# Altium schematic sheet pk36.SchDoc
size A4; SheetNumber: 1; SheetTotal: 1
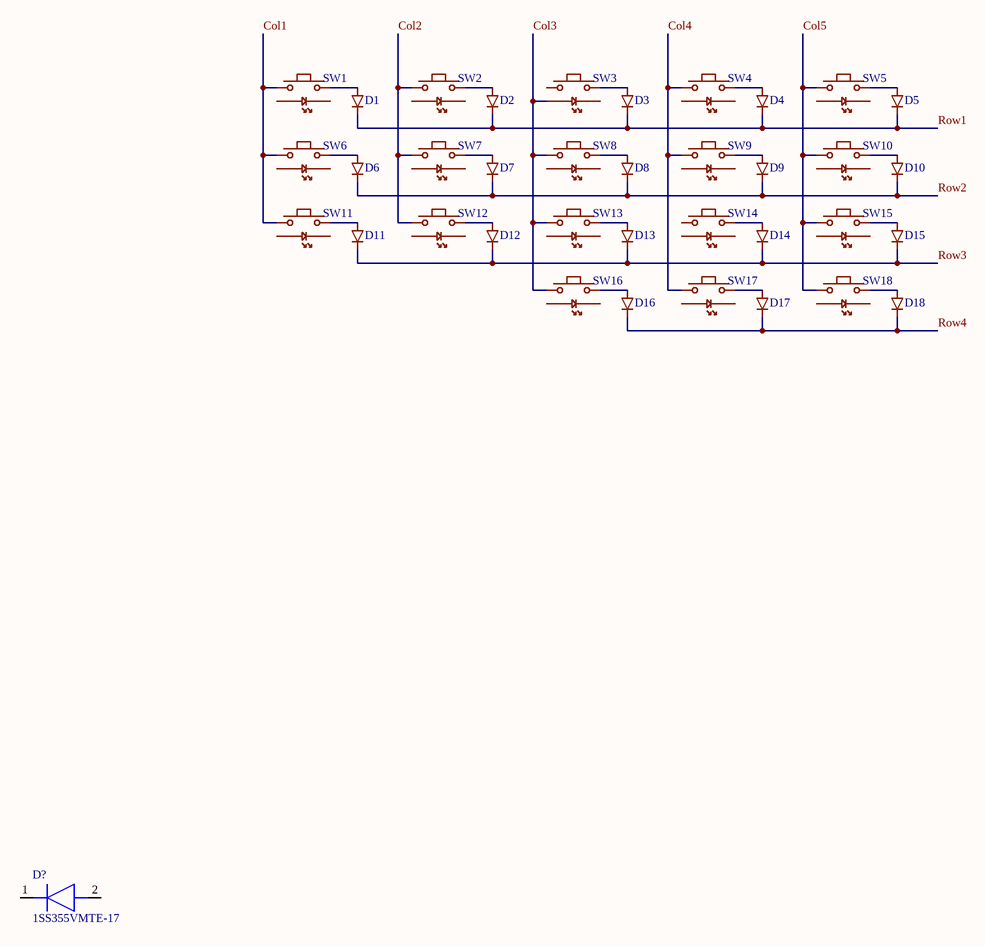
[diagram p0: pk36.SchDoc]

## Parts
D1  (no value)  [UDZVTE1722B]
D2  (no value)  [UDZVTE1722B]
D3  (no value)  [UDZVTE1722B]
D4  (no value)  [UDZVTE1722B]
D5  (no value)  [UDZVTE1722B]
D6  (no value)  [UDZVTE1722B]
D7  (no value)  [UDZVTE1722B]
D8  (no value)  [UDZVTE1722B]
D9  (no value)  [UDZVTE1722B]
D10  (no value)  [UDZVTE1722B]
D11  (no value)  [UDZVTE1722B]
D12  (no value)  [UDZVTE1722B]
D13  (no value)  [UDZVTE1722B]
D14  (no value)  [UDZVTE1722B]
D15  (no value)  [UDZVTE1722B]
D16  (no value)  [UDZVTE1722B]
D17  (no value)  [UDZVTE1722B]
D18  (no value)  [UDZVTE1722B]
D?  1SS355VMTE-17  [UDZVTE1722B]
SW1  (no value)  [kailh_low_profile_v2_led]
SW2  (no value)  [kailh_low_profile_v2_led]
SW3  (no value)  [kailh_low_profile_v2_led]
SW4  (no value)  [kailh_low_profile_v2_led]
SW5  (no value)  [kailh_low_profile_v2_led]
SW6  (no value)  [kailh_low_profile_v2_led]
SW7  (no value)  [kailh_low_profile_v2_led]
SW8  (no value)  [kailh_low_profile_v2_led]
SW9  (no value)  [kailh_low_profile_v2_led]
SW10  (no value)  [kailh_low_profile_v2_led]
SW11  (no value)  [kailh_low_profile_v2_led]
SW12  (no value)  [kailh_low_profile_v2_led]
SW13  (no value)  [kailh_low_profile_v2_led]
SW14  (no value)  [kailh_low_profile_v2_led]
SW15  (no value)  [kailh_low_profile_v2_led]
SW16  (no value)  [kailh_low_profile_v2_led]
SW17  (no value)  [kailh_low_profile_v2_led]
SW18  (no value)  [kailh_low_profile_v2_led]

## Nets
Col1: SW1.0 SW6.0 SW11.0
Col2: SW2.0 SW7.0 SW12.0
Col3: SW3.3 SW8.0 SW13.0 SW16.0
Col4: SW4.0 SW9.0 SW17.0
Col5: SW5.0 SW10.0 SW15.0 SW18.0
Row1: D1.2 D2.2 D3.2 D4.2 D5.2
Row2: D6.2 D7.2 D8.2 D9.2 D10.2
Row3: D11.2 D12.2 D13.2 D14.2 D15.2
Row4: D16.2 D17.2 D18.2
NetD1_1: D1.1 SW1.1
NetD2_1: D2.1 SW2.1
NetD3_1: D3.1 SW3.1
NetD4_1: D4.1 SW4.1
NetD5_1: D5.1 SW5.1
NetD6_1: D6.1 SW6.1
NetD7_1: D7.1 SW7.1
NetD8_1: D8.1 SW8.1
NetD9_1: D9.1 SW9.1
NetD10_1: D10.1 SW10.1
NetD11_1: D11.1 SW11.1
NetD12_1: D12.1 SW12.1
NetD13_1: D13.1 SW13.1
NetD14_1: D14.1 SW14.1
NetD15_1: D15.1 SW15.1
NetD16_1: D16.1 SW16.1
NetD17_1: D17.1 SW17.1
NetD18_1: D18.1 SW18.1

Not connected (* = marked no-connect by the designer): D? 1(K) 2(A); SW1 3 4; SW2 3 4; SW3 0 4; SW4 3 4; SW5 3 4; SW6 3 4; SW7 3 4; SW8 3 4; SW9 3 4; SW10 3 4; SW11 3 4; SW12 3 4; SW13 3 4; SW14 0 3 4; SW15 3 4; SW16 3 4; SW17 3 4; SW18 3 4

## Library data of the parts
D1-D18 = diode
D? = 1SS355VMTE-17: Diode; Manufacturer_Name: ROHM Semiconductor; Datasheet Link: https://datasheet.datasheetarchive.com/originals/distributors/Datasheets_SAMA/726503b2436a9ce4bc644e4966373f1b.pdf; Height: 0mm; Manufacturer_Part_Number: 1SS355VMTE-17; Mouser Part Number: 755-1SS355VMTE-17; Mouser Price/Stock: https://www.mouser.co.uk/ProductDetail/ROHM-Semiconductor/1SS355VMTE-17?qs=IsRgwgmxh693733hapxfjA%3D%3D
SW1-SW18 = Switch